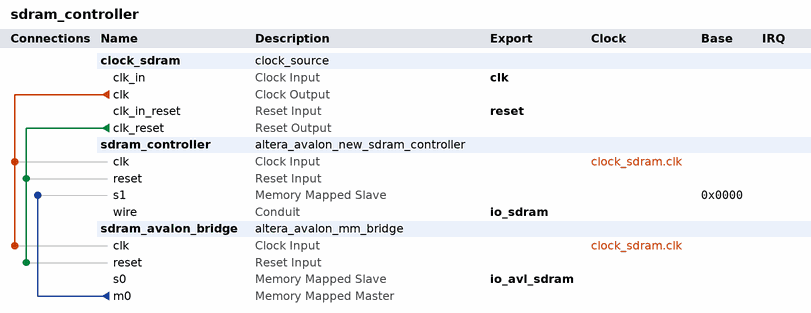
[diagram p0: system contents]
# Platform Designer (Qsys) system sdram_controller, Cyclone 10 LP 10CL016YU256C8G
# Parameters at their usual value, and those the tool derives, are not listed.
package require -exact qsys 20.1
create_system sdram_controller
set_project_property DEVICE_FAMILY {Cyclone 10 LP}
set_project_property DEVICE 10CL016YU256C8G

add_instance clock_sdram clock_source 20.1
set_instance_parameter_value clock_sdram clockFrequency 48000000

add_instance sdram_controller altera_avalon_new_sdram_controller 20.1
set_instance_parameter_value sdram_controller TAC 5.5
set_instance_parameter_value sdram_controller TRCD 20.0
set_instance_parameter_value sdram_controller TRP 20.0
set_instance_parameter_value sdram_controller casLatency 3
set_instance_parameter_value sdram_controller columnWidth 8
set_instance_parameter_value sdram_controller dataWidth 16
set_instance_parameter_value sdram_controller generateSimulationModel false
set_instance_parameter_value sdram_controller model single_Micron_MT48LC4M32B2_7_chip
set_instance_parameter_value sdram_controller numberOfBanks 4
set_instance_parameter_value sdram_controller numberOfChipSelects 1
set_instance_parameter_value sdram_controller powerUpDelay 100.0
set_instance_parameter_value sdram_controller refreshPeriod 15.625
set_instance_parameter_value sdram_controller rowWidth 12

add_instance sdram_avalon_bridge altera_avalon_mm_bridge 20.1
set_instance_parameter_value sdram_avalon_bridge ADDRESS_UNITS SYMBOLS
set_instance_parameter_value sdram_avalon_bridge ADDRESS_WIDTH 32
set_instance_parameter_value sdram_avalon_bridge DATA_WIDTH 32
set_instance_parameter_value sdram_avalon_bridge MAX_PENDING_RESPONSES 4
set_instance_parameter_value sdram_avalon_bridge USE_AUTO_ADDRESS_WIDTH 0

# connections
add_connection clock_sdram.clk sdram_avalon_bridge.clk clock
add_connection clock_sdram.clk sdram_controller.clk clock
add_connection clock_sdram.clk_reset sdram_avalon_bridge.reset reset
add_connection clock_sdram.clk_reset sdram_controller.reset reset
add_connection sdram_avalon_bridge.m0 sdram_controller.s1 avalon
set_connection_parameter_value sdram_avalon_bridge.m0/sdram_controller.s1 baseAddress 0x0000

# exported interfaces
add_interface clk clock sink
set_interface_property clk EXPORT_OF clock_sdram.clk_in
add_interface io_avl_sdram avalon slave
set_interface_property io_avl_sdram EXPORT_OF sdram_avalon_bridge.s0
add_interface io_sdram conduit end
set_interface_property io_sdram EXPORT_OF sdram_controller.wire
add_interface reset reset sink
set_interface_property reset EXPORT_OF clock_sdram.clk_in_reset

set_interconnect_requirement {$system} qsys_mm.clockCrossingAdapter HANDSHAKE
set_interconnect_requirement {$system} qsys_mm.enableEccProtection FALSE
set_interconnect_requirement {$system} qsys_mm.insertDefaultSlave FALSE
set_interconnect_requirement {$system} qsys_mm.maxAdditionalLatency 1

save_system sdram_controller.qsys
